# Altium schematic sheet altium_practice.SchDoc
size A4; SheetNumber: 1; SheetTotal: 1
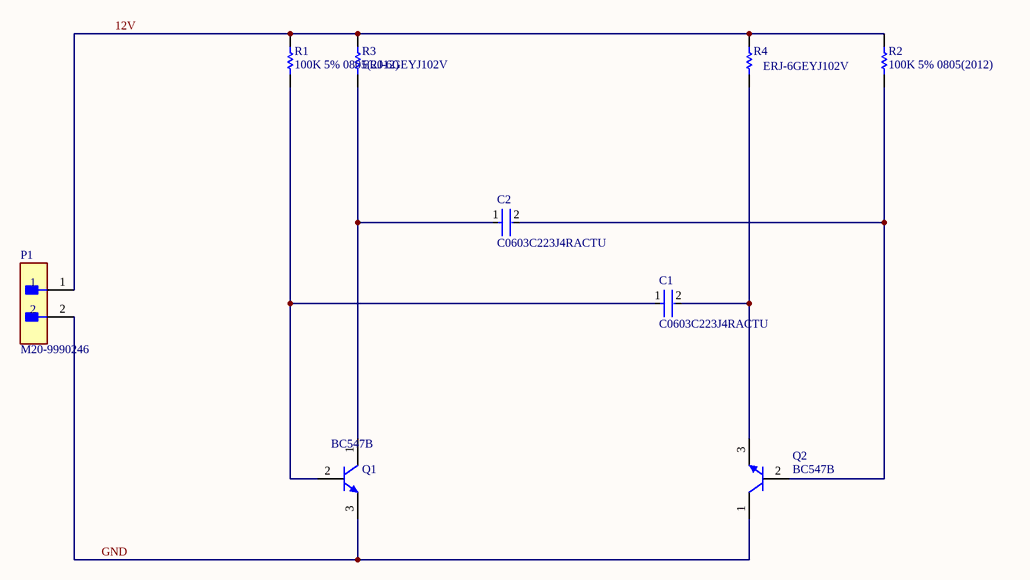
[diagram p0: altium_practice.SchDoc]

## Parts
C1  C0603C223J4RACTU  [FP-C0603C-CF-MFG]
C2  C0603C223J4RACTU  [FP-C0603C-CF-MFG]
P1  M20-9990246  [FP-M20-9990246-MFG]
Q1  BC547B  [ONSC-TO-92-3-29-11]
Q2  BC547B  [ONSC-TO-92-3-29-11]
R1  100K 5% 0805(2012)  [RESC0805(2012)_L]
R2  100K 5% 0805(2012)  [RESC0805(2012)_L]
R3  ERJ-6GEYJ102V  [RESC2013X70X40ML20T20]
R4  ERJ-6GEYJ102V  [RESC2013X70X40ML20T20]

## Nets
12V: P1.1 R1.2 R2.2 R3.2 R4.2
GND: P1.2 Q1.3(E) Q2.1(C)
NetC1_1: C1.1 Q1.2(B) R1.1
NetC1_2: C1.2 Q2.3(E) R4.1
NetC2_1: C2.1 Q1.1(C) R3.1
NetC2_2: C2.2 Q2.2(B) R2.1

## Library data of the parts
C1 C2 = CMP-2006-03745-2: CAP CER 0.022UF 16V 5% X7R 0603; Manufacturer: KEMET; Tolerance: 0.05; Automotive Grade: Grade 1; Temperature Coefficient: 30ppm/°C; Description: C0603 22,000 pF X7R 30ppm/°C 5.00% 16 V; Capacitance: 22,000 pF; Material: Ceramic; Value: 22,000 pF; ComponentLink2URL: https://api.kemet.com/component-edge/download/datasheet/C0603C100J5GACAUTO.pdf; Voltage Rating: 16 V; Digikey Description: CAP CER 0.022UF 16V 5% X7R 0603; Device Class L3: Ceramic Capacitors; Device Class L2: Capacitors; Lead Free: Yes; Automotive: Yes; Octopart: https://octopart.com/c0603c223j4ractu-kemet-12542861; Manufacturer Part Number: C0603C223J4RACTU; Temperature Range Low: -55°C; Mouser Description: Multilayer Ceramic Capacitors MLCC - SMD/SMT 16volts 22000pF X7R 5%; Temperature: -55°C to +125°C; RoHS: TRUE; Package: C0603C-CF; Device Class L1: Passive Components; ComponentLink2Description: Datasheet; Height: 0.87mm; Category: Cap; Temperature Range High: +125°C; Temperature Characteristic: X7R
P1 = CMP-15831-000009-1: CONN HEADER VERT 2POS 2.54MM; Manufacturer: Harwin; Conn Gender: Male; Description: Connector Header Through Hole 2 position 0.100" (2.54mm); Conn Orientation: Vertical; Number Of Contacts: 2; Current Rating: 3A; ComponentLink2URL: https://cdn.harwin.com/pdfs/M20-999.pdf; ComponentLink2Description: Datasheet; Package: M20-9990246; Temperature: -40°C to +105°C; Octopart: https://octopart.com/m20-9990246-harwin-2590635; Mouser Description: 2.54mm (0.1") Pitch SIL Vertical PC Tail Pin Header, 6.1mm mating pin height, tin, 2 contacts; Temperature Range High: +105°C; Device Class L1: Connectors; RoHS: TRUE; Automotive: No; Height: 8.99mm; Number Of Rows: 1; Contact Material: Tin,Nickel; Category: Conn; Pitch: 2.54mm; Lead Free: Yes; Digikey Description: CONN HEADER VERT 2POS 2.54MM; Manufacturer Part Number: M20-9990246; Temperature Range Low: -40°C; Device Class L3: unset; Device Class L2: Headers and Wire Housings
Q1 Q2 = CMP-1048-01467-1: Amplifier Transistor, NPN Silicon, 3-Pin TO-92, Bulk Box; Manufacturer: On Semiconductor; IC Continuous (A): 0.1; fT Min (MHz): 150; DatasheetVersion: Rev. 7; ComponentLink1URL: http://www.onsemi.com/; Polarity: NPN; RoHS: FALSE; ComponentLink1Description: Manufacturer URL; Packing: Bulk Box; PackageDescription: 3-Pin Transistor Outline, Body 4.825 x 3.685 mm, Pitch 1.27 mm; ComponentLink3URL: http://www.onsemi.cn/pub_link/Collateral/2N6426-D.PDF; ComponentLink2Description: Datasheet; PackageVersion: Rev. AM; PackageReference: TO-92-3-29-11_AM_SL; ComponentLink3Description: Package Specification; Mounting Technology: Through Hole; PartNumber: BC547B; ComponentLink2URL: http://www.onsemi.com/pub_link/Collateral/BC546-D.PDF
R1 R2 = CMP-1013-00122-1: 100K 0.125W 5% 0805 (2012 Metric)  SMD; Case-Metric: 2012; Value: 100000.00 Ohm; Case-EIA: 0805; Tolerance: 5 %; Technology: SMT; Power: 0.125 W
R3 R4 = CMP-2001-00336-1: Manufacturer: Panasonic; Part Number: ERJ-6GEYJ102V